# Altium schematic sheet Wheatstone_bridge.SchDoc: Wheatstone bridge
size A4; Engineer: Danel Tiitma; DocumentNumber: 14; Revision: 1; SheetNumber: 15; SheetTotal: 15
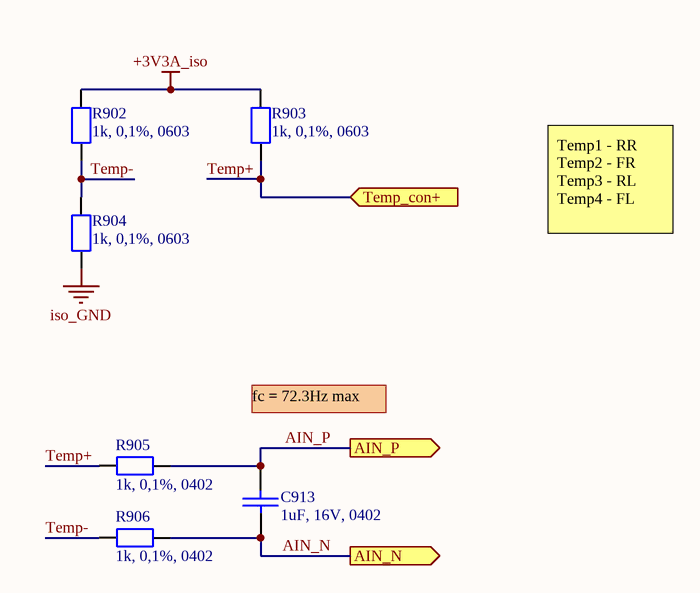
[diagram p0: Wheatstone_bridge.SchDoc]

## Parts
C913  1uF, 16V, 0402  [CAP [0402] 1005]
R902  1k, 0,1%, 0603  [RES [0603] 1608]
R903  1k, 0,1%, 0603  [RES [0603] 1608]
R904  1k, 0,1%, 0603  [RES [0603] 1608]
R905  1k, 0,1%, 0402  [RES [0402] 1005]
R906  1k, 0,1%, 0402  [RES [0402] 1005]

## Ports
AIN_N (out), AIN_P (out), Temp_con+ (in)

## Nets
+3V3A_iso: R902.1 R903.1
iso_GND: R904.2
AIN_N: C913.2 R906.1 ; port AIN_N
AIN_P: C913.1 R905.1 ; port AIN_P
Temp+: R903.2 R905.2 ; port Temp_con+
Temp-: R902.2 R904.1 R906.2

## Notes on the sheet
- Temp1 - RR
  Temp2 - FR
  Temp3 - RL
  Temp4 - FL
- fc = 72.3Hz max
- Engineer:
- Date:
- Rev:

## Library data of the parts
C913 = CMP-001-00084-16: Default capacitor part; Supplier Part Number: *; Supplier: *; Manufacturer Part Number: *
R902-R904 = CMP-009-00017-1: Fixed Resistor, Thin Film, 0.1W, 1000ohm, 75V, 0.1% +/-Tol, 25ppm/Cel, Surface Mount, 0603; Manufacturer: Panasonic; Manufacturer Part Number: ERA-3AEB102V; Price: 0.288; Supplier Part Number: 667-ERA-3AEB102V; Supplier: Mouser
R905 R906 = CMP-009-00038-12: Standard resistor part; Supplier Part Number: *; Manufacturer Part Number: *; Supplier: *